# EAGLE design nerves_key1 (EAGLE 9.1.0)
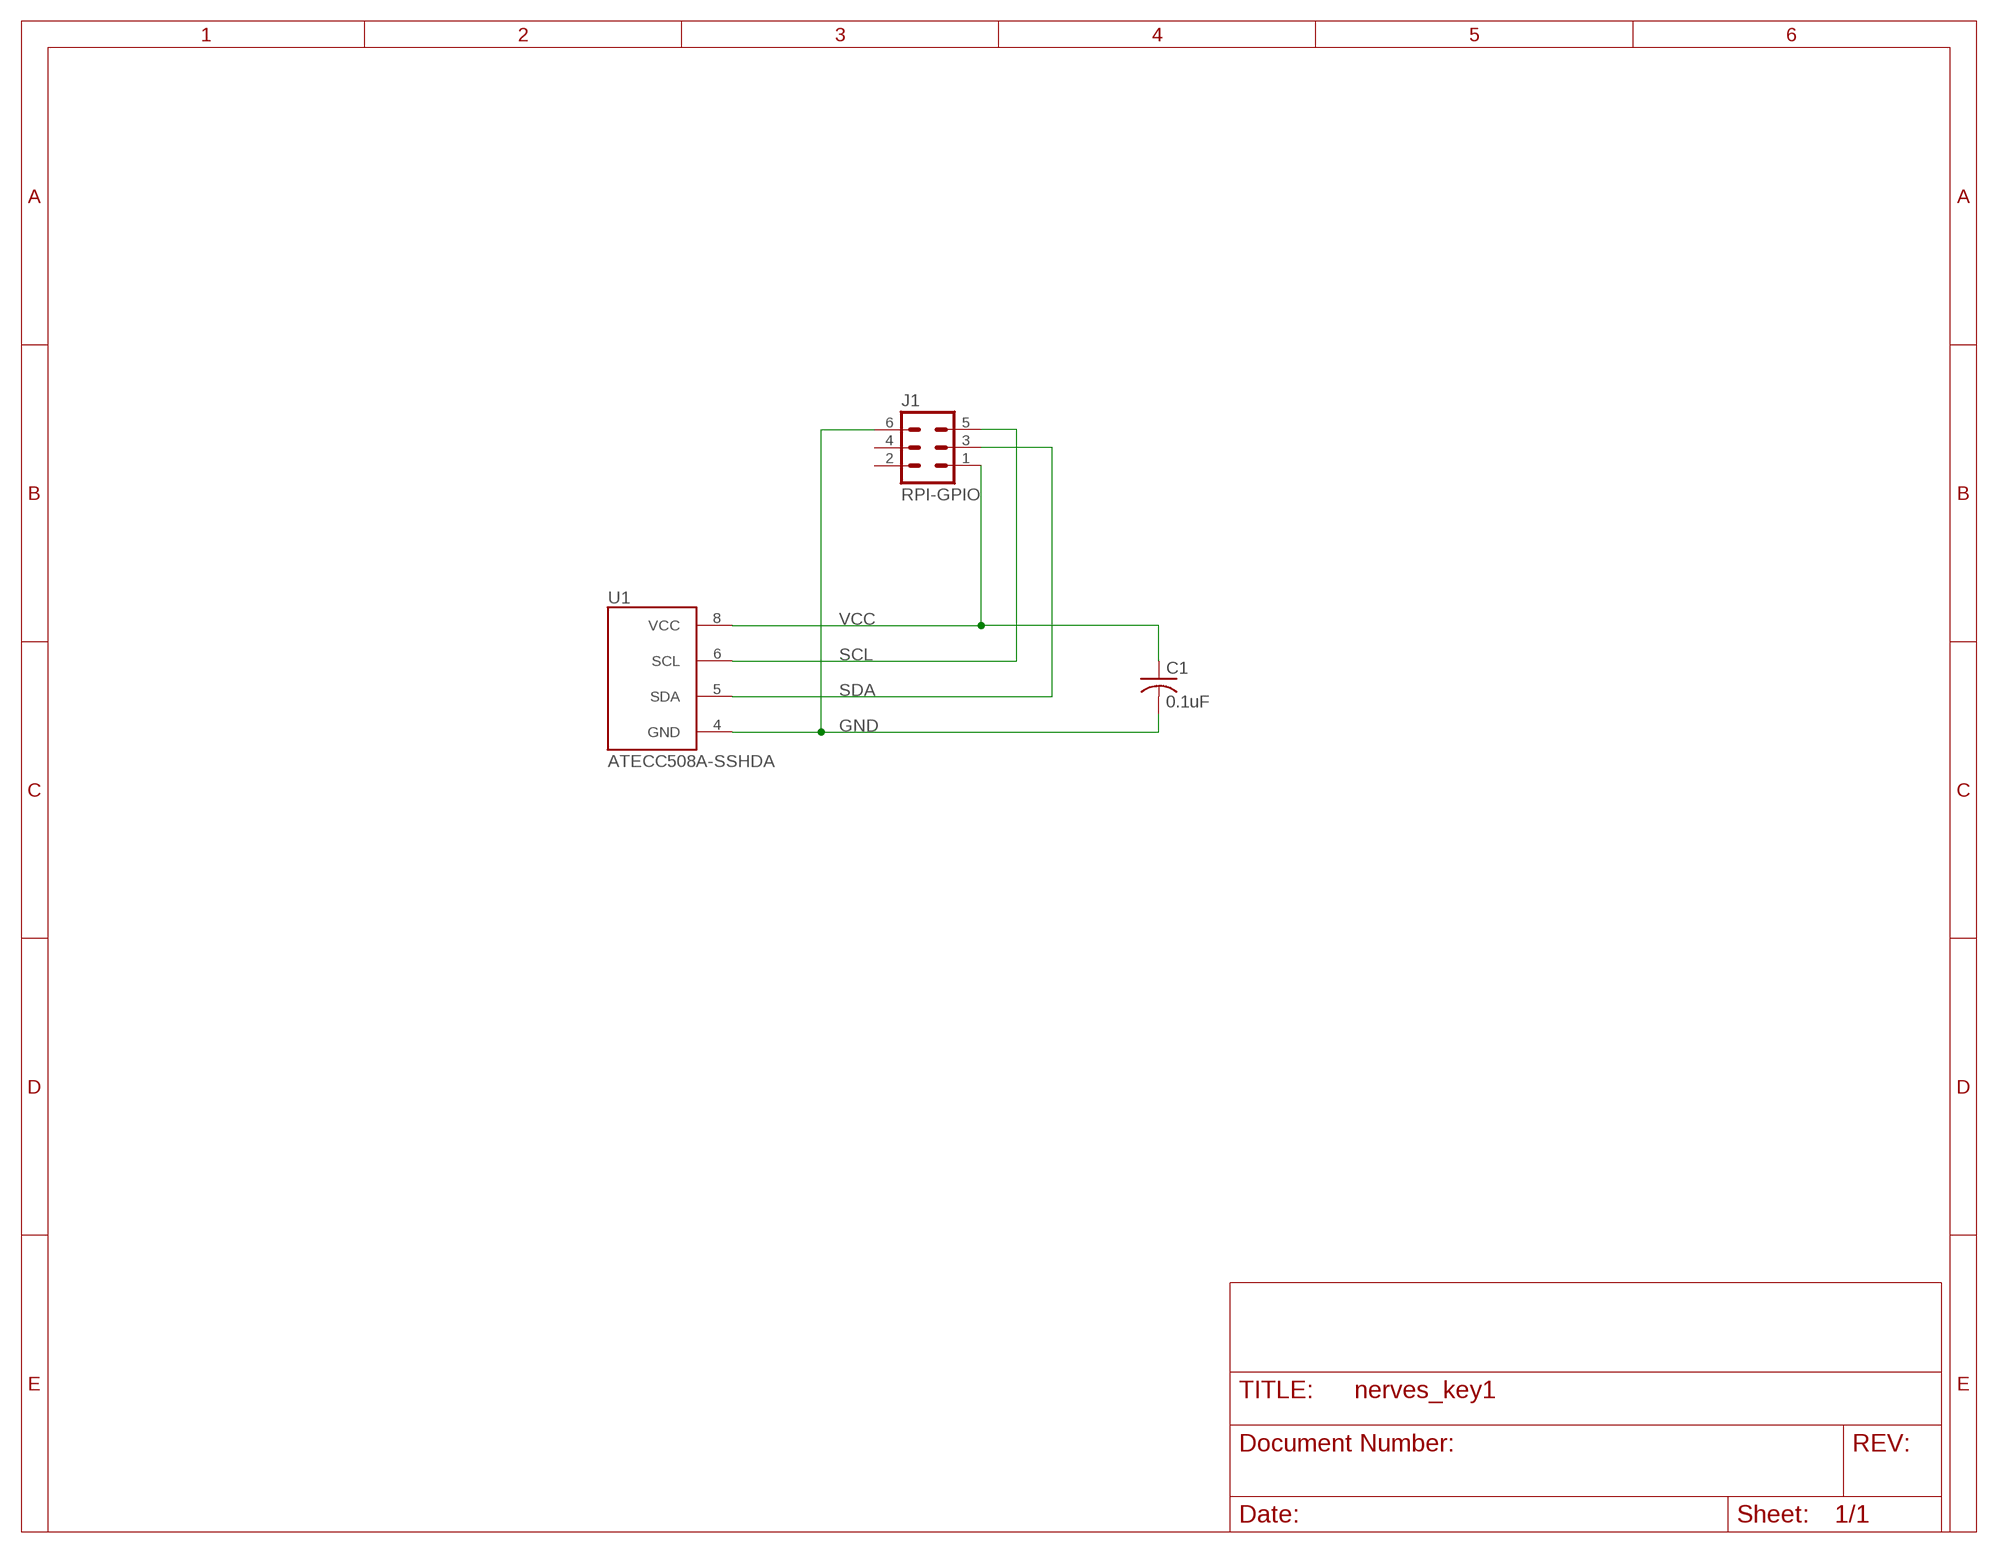
[diagram p0: schematic, sheet 1]

## Parts
C1  0.1uF  C-USC0805  [C0805]
J1  RPI-GPIO  MA03-2  [MA03-2]
U1  ATECC508A-SSHDA  ATECC508ASOIC-8-NARROW  [SOIC127P625X175-8]

## Nets
GND: C1.2 J1.6 U1.4(GND)
SCL: J1.5 U1.6(SCL)
SDA: J1.3 U1.5(SDA)
VCC: C1.1 J1.1 U1.8(VCC)
Unconnected: J1.2 J1.4

## Library data of the parts
C1 = rcl:C-US: CAPACITOR, American symbol; SPICEPREFIX: C
J1 = con-lstb:MA03-2: PIN HEADER; OC_FARNELL: unknown; OC_NEWARK: unknown
U1 = cryptopi:ATECC508A

## Board
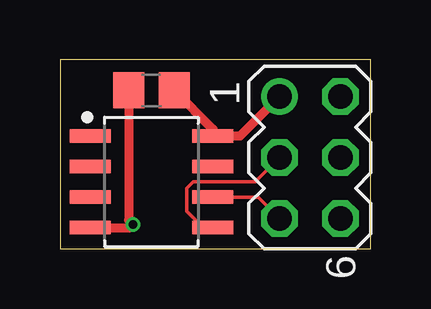
[diagram p1: board, top side]
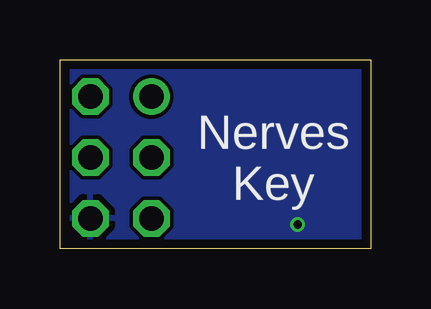
[diagram p2: board, bottom side, seen from below]

Size 12.95 x 7.87 mm. Coordinates in mm from the lower left corner, seen from the top.
Outline: 0,0 12.95,0 12.95,7.87 0,7.87 0,0
Copper layers (1*16): Top 0.035559375mm / dielectric 1.6mm / Bottom 0.035559375mm
Design rules "oshpark-2layer *": minimum track width 6mil, minimum drill 10mil, track to track 6mil, track to pad 6mil, pad to pad 6mil, via to via 6mil, smd to smd 6mil, copper to edge 15mil, drill to drill 6mil, minimum pad ring 5mil, minimum via ring 5mil, stop-mask expansion 2.5mil, vias tented up to drill 15mil, thermal gap 10mil

### Footprints (pad centres in the part's own frame; a part is rotated, then mirrored left to right if it is on the bottom)
C0805 = smd 1.3 x 1.5: 1 -0.95,0; 2 0.95,0
MA03-2 = drill 1.016: 1 -2.54,-1.27 | drill 1.016 octagon: 2 -2.54,1.27; 3 0,-1.27; 4 0,1.27; 5 2.54,-1.27; 6 2.54,1.27
SOIC127P625X175-8 = smd 1.7 x 0.559: 1 -2.556,1.905; 2 -2.556,0.635; 3 -2.556,-0.635; 4 -2.556,-1.905; 5 2.556,-1.905; 6 2.556,-0.635; 7 2.556,0.635; 8 2.556,1.905

### Placement (x,y rotation side)
C1  3.81,6.6 180 top
J1  10.41,3.81 270 top
U1  3.81,2.79 0 top

### Tracks (layer width: path | path; a pad name or v marks a point on that pad's centre or on a via)
GND  (via drill 0.35)
  Top 0.381: C1.2 2.86,1.2 v3.05,1.02 2.92,0.89 U1.4
  pour Bottom: 0,7.87 0,0 12.95,0 12.95,7.87
SCL
  Top 0.152: J1.5 8.26,2.16 U1.6
SDA
  Top 0.152: J1.3 8.13,2.79 5.55,2.79 5.29,2.53 5.29,1.57 5.97,0.89 U1.5
VCC
  Top 0.381: C1.1 6.37,5 U1.8 7.49,4.7 J1.1

### Text on the board
bNames: Nerves / Key